# EAGLE design Fathom-X (EAGLE 7.4.0)

## Sheet 1 of 2
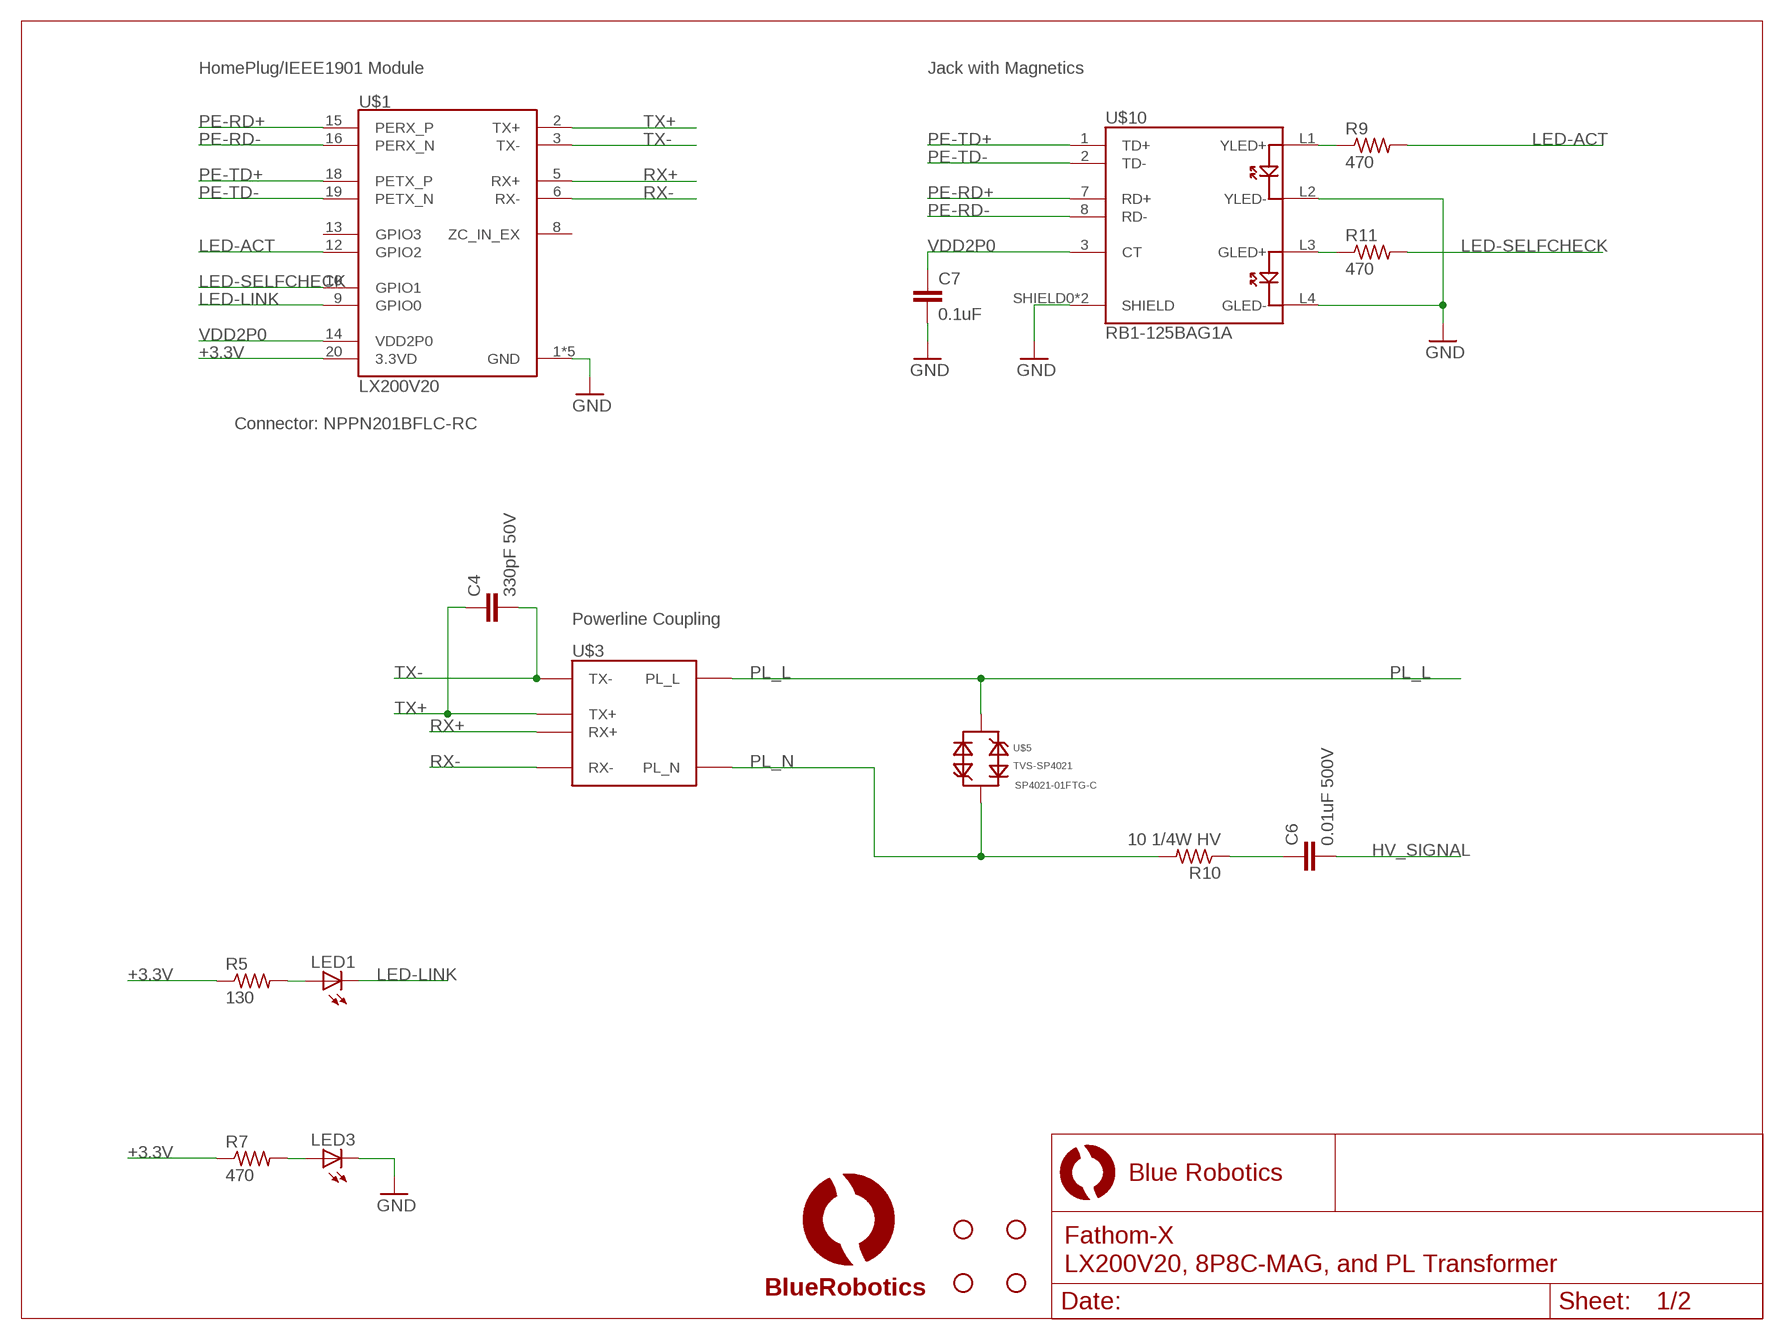
[diagram p0: schematic, sheet 1]

### Parts
C4  330pF 50V  C-EUC0805  [C0805]
C6  0.01uF 500V  C-EUC1206  [C1206]
C7  0.1uF  C-EUC0603  [C0603]
LED1  LEDCHIPLED_0603  [CHIPLED_0603]
LED3  LEDCHIPLED_0603  [CHIPLED_0603]
R5  130  R-US_R0603  [R0603]
R7  470  R-US_R0603  [R0603]
R9  470  R-US_R0603  [R0603]
R10  10 1/4W HV  R-US_R1206  [R1206]
R11  470  R-US_R0603  [R0603]
STANDOFF1  STAND-OFF  [STAND-OFF]
STANDOFF2  STAND-OFF  [STAND-OFF]
STANDOFF3  STAND-OFF  [STAND-OFF]
STANDOFF5  STAND-OFF  [STAND-OFF]
U$1  LX200V20  [LX200V20]
U$3  UT11403S  [UT11403S]
U$5  TVS-SP4021  [SOD323-BIDIRECTIONAL]
U$6  LOGOBR-LOGO-MS-COPPER  [BR-LOGO-MEDIUM-SMALL-COPPER]
U$10  RB1-125BAG1A  RJ45-MAG  [RJ45-MAG-WIZNET]

### Nets
+3.3V: R5.1 R7.1 U$1.20(3.3VD) ; also sheet 2
GND: C7.2 LED3.C U$1.1(GND) U$1.4(GND) U$1.7(GND) U$1.11(GND) U$1.17(GND) U$10.L2(YLED-) U$10.L4(GLED-) U$10.SHIELD0(SHIELD) U$10.SHIELD1(SHIELD) ; also sheet 2
HV_SIGNAL [high-voltage]: C6.2 ; also sheet 2
LED-ACT: R9.2 U$1.12(GPIO2)
LED-LINK: LED1.C U$1.9(GPIO0)
LED-SELFCHECK: R11.2 U$1.10(GPIO1)
N$6: LED1.A R5.2
N$8: LED3.A R7.2
N$11 [high-voltage]: C6.1 R10.1
N$12: R9.1 U$10.L1(YLED+)
N$13: R11.1 U$10.L3(GLED+)
PE-RD+: U$1.15(PERX_P) U$10.7(RD+)
PE-RD-: U$1.16(PERX_N) U$10.8(RD-)
PE-TD+: U$1.18(PETX_P) U$10.1(TD+)
PE-TD-: U$1.19(PETX_N) U$10.2(TD-)
PL_L [high-voltage]: U$3.PL_L U$5.2 ; also sheet 2
PL_N [high-voltage]: R10.2 U$3.PL_N U$5.1
RX+: U$1.5(RX+) U$3.RX+
RX-: U$1.6(RX-) U$3.RX-
TX+: C4.1 U$1.2(TX+) U$3.TX+
TX-: C4.2 U$1.3(TX-) U$3.TX-
VDD2P0: C7.1 U$1.14(VDD2P0) U$10.3(CT)
Unconnected: U$1.8(ZC_IN_EX) U$1.13(GPIO3)

### Notes on the sheet
- HomePlug/IEEE1901 Module | Jack with Magnetics
- Connector: NPPN201BFLC-RC
- Powerline Coupling
- SP4021-01FTG-C

## Sheet 2 of 2
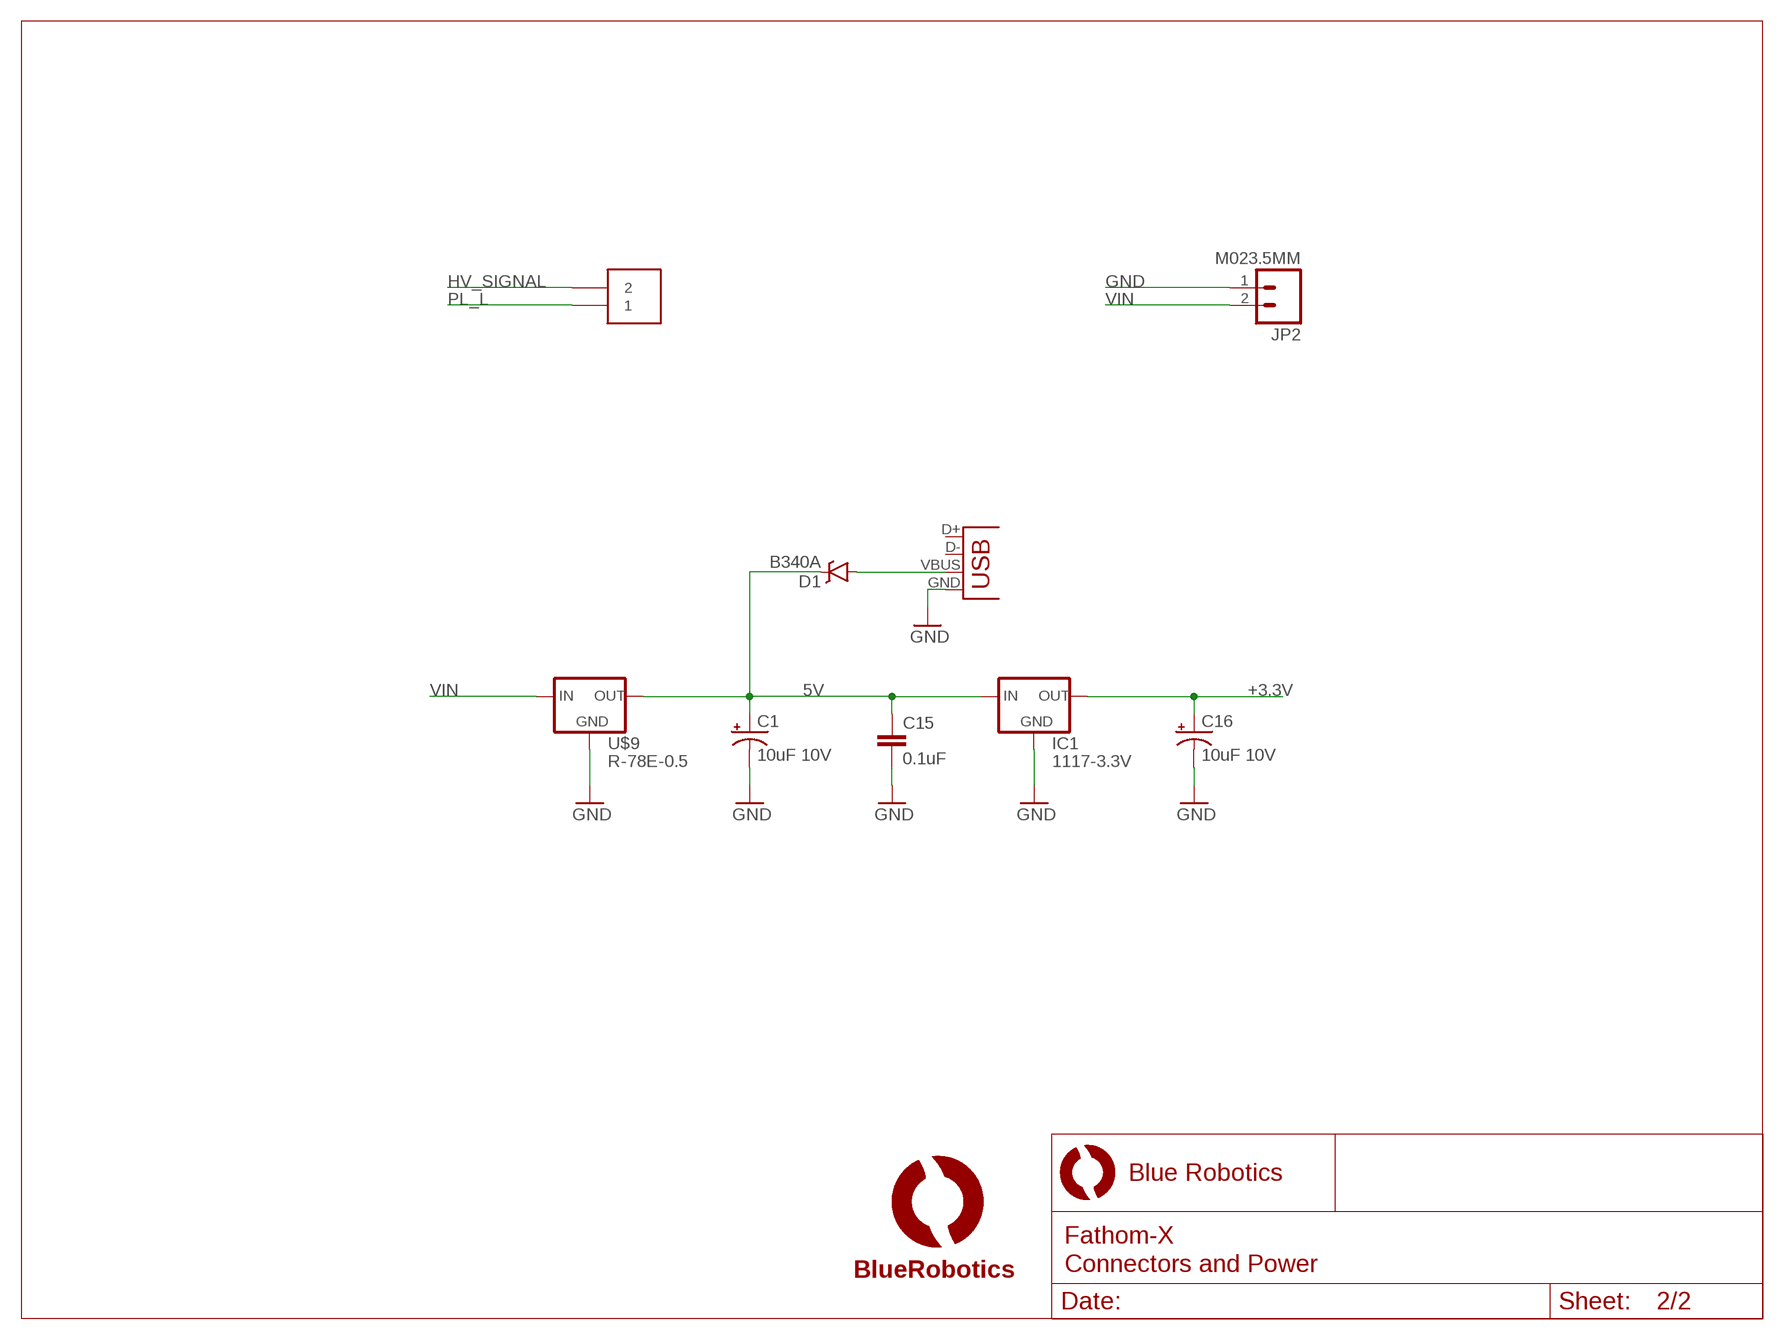
[diagram p1: schematic, sheet 2]

### Parts
C1  10uF 10V  CAP_POL1206  [EIA3216]
C15  0.1uF  CAP0603-CAP  [0603-CAP]
C16  10uF 10V  CAP_POL1206  [EIA3216]
D1  B340A  DIODE-SCHOTTKY-B340A  [SMA-DIODE]
IC1  1117-3.3V  VREG-1117-FIXEDSOT223  [SOT223]
JP2  M023.5MM  [SCREWTERMINAL-3.5MM-2]
JP3  USBSMD  [USB-MINIB]
U$7  LOGOFULL-M  [BR-FULL-LOGO-MEDIUM]
U$8  HEADER-210.16MM  [HEADER-10.16MM-2POS]
U$9  R-78E-0.5  VREG-R-78E-0.5  [R-78E-0.5]

### Nets
5V: C1.A(+) C15.1 D1.C IC1.3(IN) U$9.VOUT(OUT)
+3.3V: C16.A(+) IC1.2(OUT) ; also sheet 1
GND: C1.C(-) C15.2 C16.C(-) IC1.1(GND) JP2.1 JP3.GND U$9.GND ; also sheet 1
HV_SIGNAL [high-voltage]: U$8.P$2 ; also sheet 1
N$1: D1.A JP3.VBUS
PL_L [high-voltage]: U$8.P$1 ; also sheet 1
VIN: JP2.2 U$9.VIN(IN)
Unconnected: JP3.D+ JP3.D-

## Library data of the parts
C1 C16 = SparkFun-Passives:CAP_POL: Capacitor Polarized These are standard SMD and PTH capacitors. Normally 10uF, 47uF, and 100uF in electrolytic and tantalum varieties. Always verify the external diameter of the through hole cap, it varies with capacity, voltage, and manufacturer. The EIA devices should be standard.
C4 C6 C7 = resistor:C-EU: CAPACITOR, European symbol
C15 = SparkFun-Passives:CAP: Capacitor Standard 0603 ceramic capacitor, and 0.1" leaded capacitor.
D1 = SparkFun-DiscreteSemi:DIODE-SCHOTTKY: Schottky diodes in SFE's production catalog BAT20J 1A 23V 0.62Vf RB751 120mA 40V 0.37Vf PMEG4005EJ 0.5A 40V 0.42Vf MBRA140 1A 40V 0.5Vf B340A 3A 40V SMA; PROD_ID: DIO-09886
IC1 = BlueRobotics-Main:VREG-1117-FIXED: Voltage Regulator LM1117 Standard adjustable voltage regulator but in SMD form. Spark Fun Electronics SKU : COM-00595
JP2 = SparkFun-Connectors:M02: Standard 2-pin 0.1" header. Use with - straight break away headers ( PRT-00116) - right angle break away headers (PRT-00553) - swiss pins (PRT-00743) - machine pins (PRT-00117) - female headers (PRT-00115) Molex polarized connector foot print use with: PRT-08233 with associated crimp pins and housings. 2.54_SCREWTERM for use with PRT-10571. 3.5mm Screw Terminal footprints for PRT-08084 5mm Screw Terminal footprints for use with PRT-08433
JP3 = SparkFun-Connectors:USB: USB Connectors USB-B-PTH is fully proven SKU : PRT-00139/CONN-08278 USB-miniB is fully proven SKU : PRT-00587 USB-A-PCB is untested. USB-A-H is throughly reviewed, but untested. Spark Fun Electronics SKU : PRT-00437 USB-B-SMT is throughly reviewed, but untested. Needs silkscreen touching up. USB-A-S has not been used/tested USB-MB-H has not been used/tested USB-MICROB has been used. CONN-09505; PROD_ID: CONN-08193
LED1 LED3 = led:LED: LED OSRAM: - CHIPLED LG R971, LG N971, LY N971, LG Q971, LY Q971, LO R971, LY R971 LH N974, LH R974 LS Q976, LO Q976, LY Q976 LO Q996 - Hyper CHIPLED LW Q18S LB Q993, LB Q99A, LB R99A - SideLED LS A670, LO A670, LY A670, LG A670, LP A670 LB A673, LV A673, LT A673, LW A673 LH A674 LY A675 LS A676, LA A676, LO A676, LY A676, LW A676 LS A679, LY A679, LG A679 - Hyper Micro SIDELED® LS Y876, LA Y876, LO Y876, LY Y876 LT Y87S - SmartLED LW L88C, LW L88S LB L89C, LB L89S, LG L890 LS L89K, LO L89K, LY L89K LS L896, LA L896, LO L896, LY L896 - TOPLED LS T670, LO T670, LY T670, LG T670, LP T670 LSG T670, LSP T670, LSY T670, LOP T670, LYG T670 LG T671, LOG T671, LSG T671 LB T673, LV T673, LT T673, LW T673 LH T674 LS T676, LA T676, LO T676, LY T676, LB T676, LH T676, LSB T676, LW T676 LB T67C, LV T67C, LT T67C, LS T67K, LO T67K, LY T67K, LW E67C LS E67B, LA E67B, LO E67B, LY E67B, LB E67C, LV E67C, LT E67C LW T67C LS T679, LY T679, LG T679 LS T770, LO T770, LY T770, LG T770, LP T770 LB T773, LV T773, LT T773, LW T773 LH T774 LS E675, LA E675, LY E675, LS T675 LS T776, LA T776, LO T776, LY T776, LB T776 LHGB T686 LT T68C, LB T68C - Hyper Mini TOPLED® LB M676 - Mini TOPLED Santana® LG M470 LS M47K, LO M47K, LY M47K Source: http://www.osram.convergy.de LUXEON: - LUMILED® LXK2-PW12-R00, LXK2-PW12-S00, LXK2-PW14-U00, LXK2-PW14-V00 LXK2-PM12-R00, LXK2-PM12-S00, LXK2-PM14-U00 LXK2-PE12-Q00, LXK2-PE12-R00, LXK2-PE12-S00, LXK2-PE14-T00, LXK2-PE14-U00 LXK2-PB12-K00, LXK2-PB12-L00, LXK2-PB12-M00, LXK2-PB14-N00, LXK2-PB14-P00, LXK2-PB14-Q00 LXK2-PR12-L00, LXK2-PR12-M00, LXK2-PR14-Q00, LXK2-PR14-R00 LXK2-PD12-Q00, LXK2-PD12-R00, LXK2-PD12-S00 LXK2-PH12-R00, LXK2-PH12-S00 LXK2-PL12-P00, LXK2-PL12-Q00, LXK2-PL12-R00 Source: www.luxeon.com KINGBRIGHT: KA-3528ASYC Source: www.kingbright.com
R5 R7 R9-R11 = resistor:R-US_: RESISTOR, American symbol
STANDOFF1-STANDOFF3 STANDOFF5 = SparkFun-Electromechanical:STAND-OFF: #4 Stand Off This is the mechanical footprint for a #4 phillips button head screw. Use the keepout ring to avoid running the screw head into surrounding components. SKU : PRT-00447
U$1 = BR-Eagle-Library:LX200V20
U$3 = BlueRobotics-Main:UT11403S
U$5 = BlueRobotics-Main:TVS-SP4021
U$6 U$7 = BlueRobotics-Main:LOGO
U$8 = BlueRobotics-Main:HEADER-2
U$9 = BlueRobotics-Main:VREG-R-78E-0.5
U$10 = BlueRobotics-Main:RJ45-MAG

## Net classes
1 high-voltage: clearance 0.762 mm

## Board
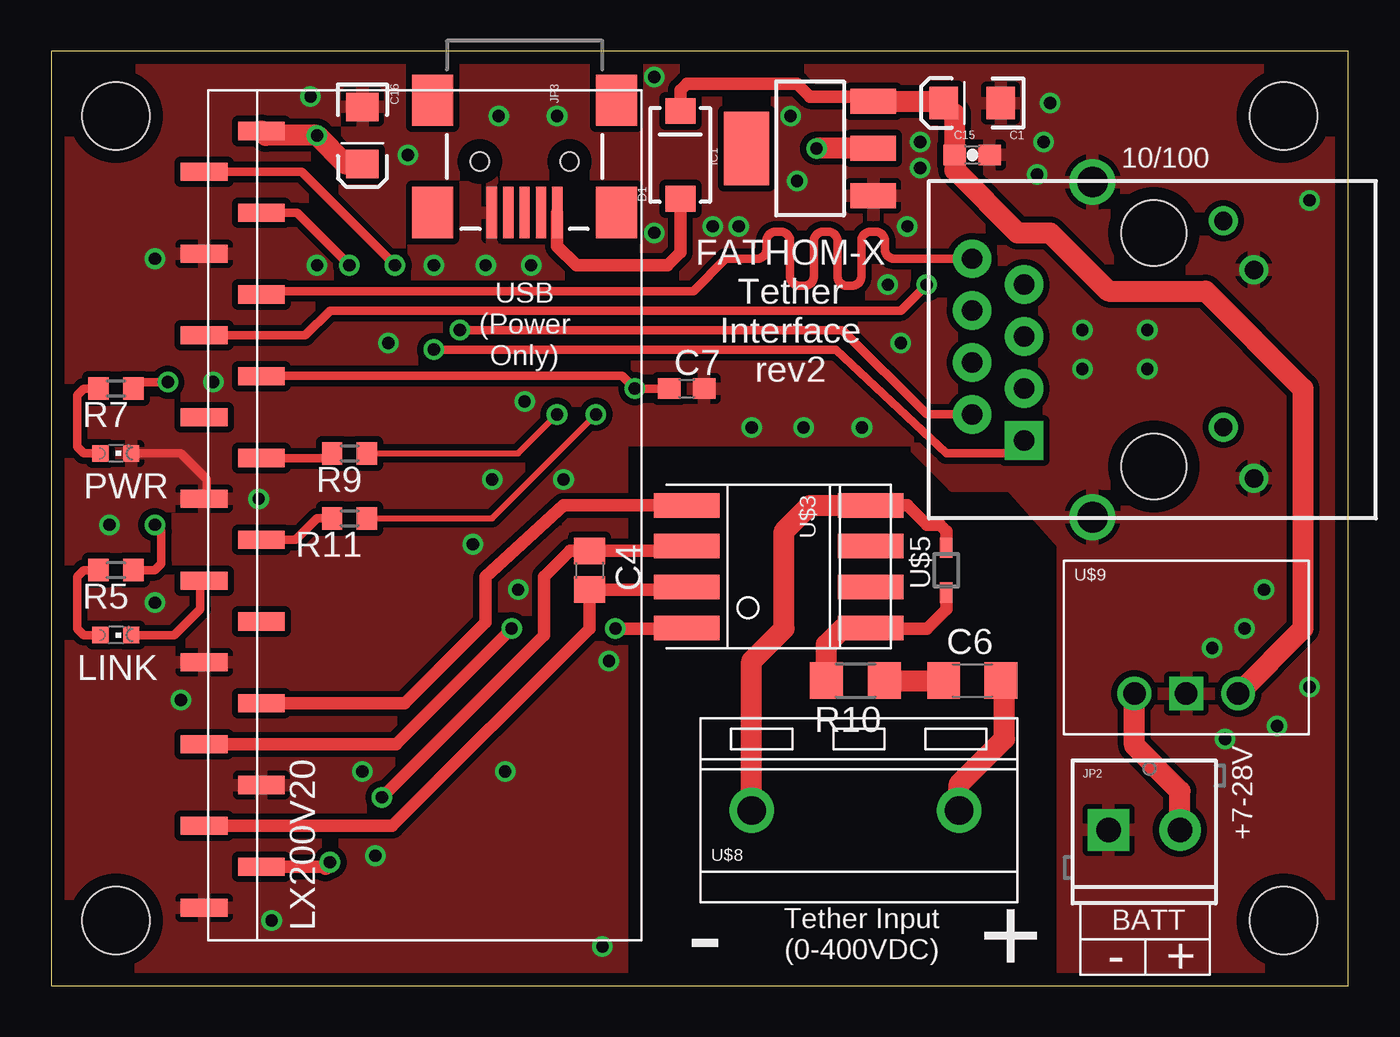
[diagram p2: board, top side]
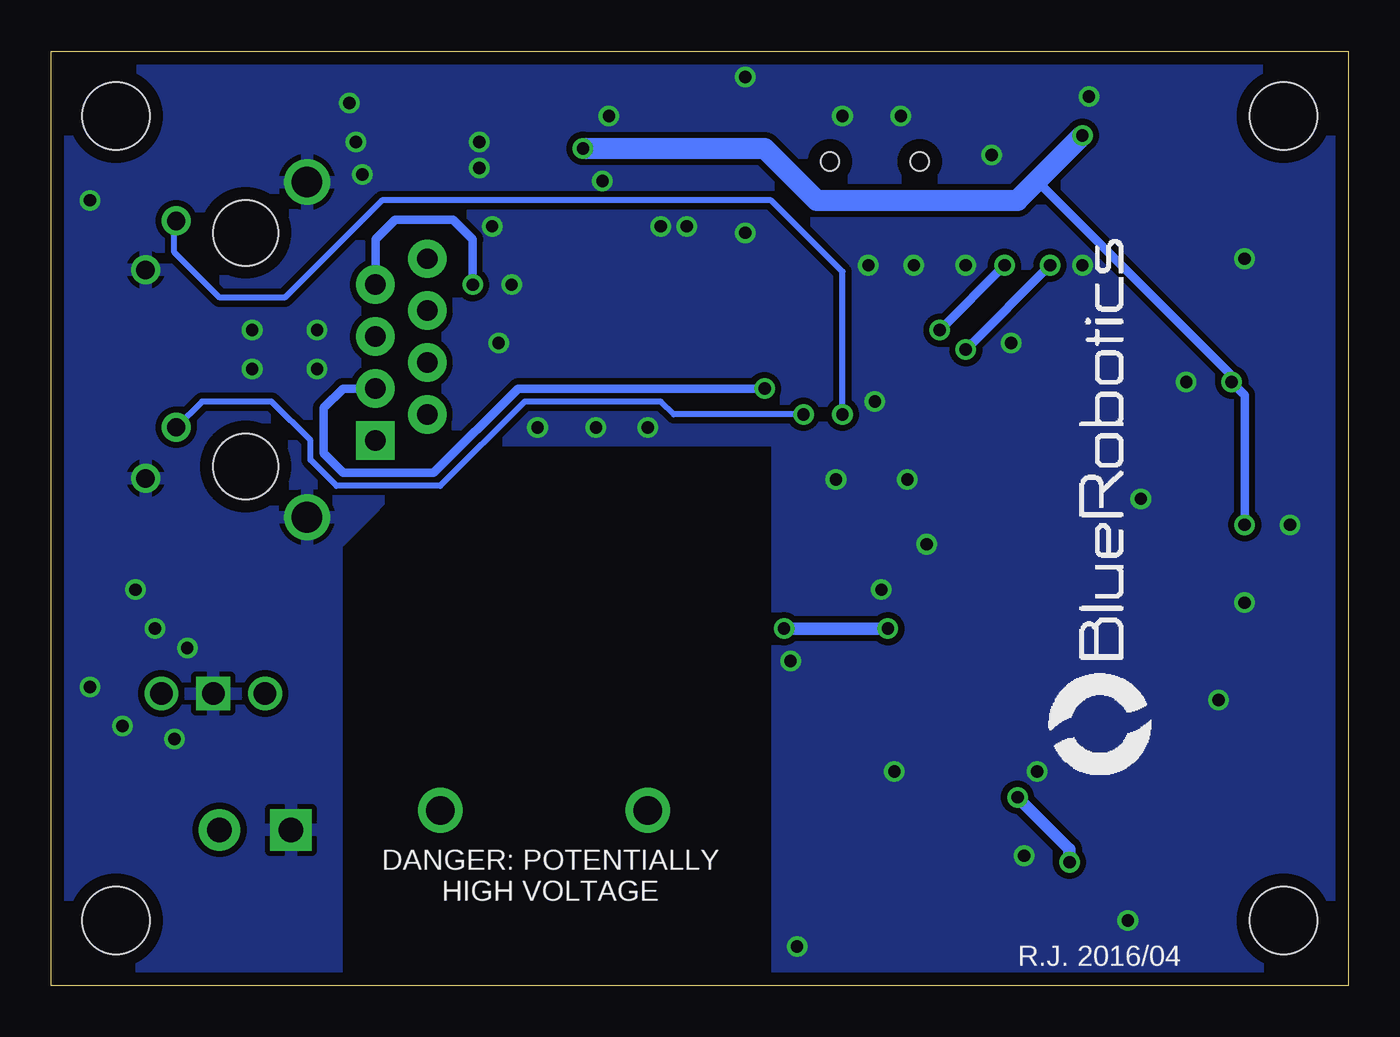
[diagram p3: board, bottom side, seen from below]

Size 63.5 x 45.72 mm. Coordinates in mm from the lower left corner, seen from the top.
Outline: 0,0 63.5,0 63.5,45.72 0,45.72 0,0
Copper layers (1*16): Top 0.035mm / dielectric 1.5mm / Bottom 0.035mm
Design rules "default *": minimum track width 10mil, minimum drill 13mil, track to track 8mil, track to pad 8mil, pad to pad 8mil, via to via 8mil, smd to smd 8mil, copper to edge 25mil, drill to drill 8mil, minimum pad ring 10mil, minimum via ring 8mil, stop-mask expansion 4mil, vias tented up to drill 30mil, thermal gap 10mil

### Footprints (pad centres in the part's own frame; a part is rotated, then mirrored left to right if it is on the bottom)
EIA3216 = smd 1.4 x 1.6: A 1.4,0; C -1.4,0
C0805 = smd 1.3 x 1.5: 1 -0.95,0; 2 0.95,0
C1206 = smd 1.6 x 1.8: 1 -1.4,0; 2 1.4,0
C0603 = smd 1.1 x 1: 1 -0.85,0; 2 0.85,0
0603-CAP = smd 1.1 x 1: 1 -0.85,0; 2 0.85,0
SMA-DIODE = smd 1.27 x 1.47: A -2.15,0; C 2.15,0
SOT223 = smd 1.219 x 2.235: 1 -2.311,-3.099; 2 0,-3.099; 3 2.311,-3.099 | smd 3.6 x 2.2: 4 0,3.099
SCREWTERMINAL-3.5MM-2 = drill 1.2 pad 2.032 square: 1 0,0 | drill 1.2 pad 2.032: 2 3.5,0
USB-MINIB = smd 2.5 x 0.5: D+ 2.5,0; D- 2.5,0.8; GND 2.5,-1.6; ID 2.5,-0.8; VBUS 2.5,1.6 | smd 2.5 x 2: MTN1 -3,4.5; MTN2 2.5,4.5; MTN3 -3,-4.5; MTN4 2.5,-4.5 | hole 0.9: 0,2.2; 0,-2.2
CHIPLED_0603 = smd 0.8 x 0.8: A 0,-0.75; C 0,0.75
R0603 = smd 1 x 1.1: 1 -0.85,0; 2 0.85,0
R1206 = smd 1.6 x 1.803: 1 -1.422,0; 2 1.422,0
STAND-OFF = hole 3.302: 0,0
LX200V20 = smd 0.89 x 2.29: 1 0,1.4; 2 2,-1.4; 3 4,1.4; 4 6,-1.4; 5 8,1.4; 6 10,-1.4; 7 12,1.4; 8 14,-1.4; 9 16,1.4; 10 18,-1.4; 11 20,1.4; 12 22,-1.4; 13 24,1.4; 14 26,-1.4; 15 28,1.4; 16 30,-1.4; 17 32,1.4; 18 34,-1.4; 19 36,1.4; 20 38,-1.4
UT11403S = smd 1.2 x 3.2: NC0 4,9; NC1 2,9; PL_L 0,9; PL_N 6,9; RX+ 6,0; RX- 0,0; TX+ 2,0; TX- 4,0
SOD323-BIDIRECTIONAL = smd 1 x 0.6: 1 -1.1,0; 2 1.1,0
HEADER-10.16MM-2POS = drill 1.4 pad 2.184: P$1 0,0; P$2 10.16,0
R-78E-0.5 = drill 1.1 square: GND 0,0 | drill 1.1: VIN -2.54,0; VOUT 2.54,0
RJ45-MAG-WIZNET = drill 1 pad 1.88 square: 1 -4.445,6.35 | drill 1 pad 1.88: 2 -3.175,8.89; 3 -1.905,6.35; 4 -0.635,8.89; 5 0.635,6.35; 6 1.905,8.89; 7 3.175,6.35; 8 4.445,8.89 | drill 0.9: L1 6.3,-3.4; L2 3.9,-4.9; L3 -3.8,-3.4; L4 -6.3,-4.9 | drill 1.5: SHIELD0 -8.2,3; SHIELD1 8.2,3 | hole 3.2: -5.715,0; 5.715,0

### Placement (x,y rotation side)
C1  45.09,43.18 180 top
C4  26.35,20.32 270 top
C6  45.09,14.92 0 top
C7  31.11,29.21 0 top
C15  45.09,40.64 0 top
C16  15.24,41.59 270 top
D1  30.8,40.64 90 top
IC1  37.15,40.96 90 top
JP2  51.75,7.62 0 top
JP3  23.18,40.32 270 top
LED1  3.17,17.14 270 top
LED3  3.17,26.04 270 top
R5  3.17,20.32 180 top
R7  3.17,29.21 180 top
R9  14.61,26.04 180 top
R10  39.37,14.92 180 top
R11  14.61,22.86 180 top
STANDOFF1  3.17,3.17 0 top
STANDOFF2  60.33,3.17 0 top
STANDOFF3  60.33,42.55 0 top
STANDOFF5  3.17,42.55 0 top
U$1  8.89,3.81 90 top
U$3  31.11,23.5 270 top
U$5  43.81,20.32 90 top
U$6  1.27,7.62 0 top
U$7  8.26,8.26 90 bottom
U$8  34.29,8.57 0 top
U$9  55.56,14.29 0 top
U$10  53.98,31.11 90 top

### Tracks (layer width: path | path; a pad name or v marks a point on that pad's centre or on a via)
5V
  Top 0.61: D1.C 30.8,43.81 31.11,44.13 36.51,44.13 37.15,43.5 40.02,43.5 IC1.3 | 43.6,43.27 C1.A 44.23,42.63 | 57.78,13.97 U$9.VOUT
  Top 1.016: IC1.3 43.6,43.27 | 44.23,42.63 C15.1 44.23,39.9 47.31,36.83 48.9,36.83 51.75,33.97 56.52,33.97 61.28,29.21 61.28,17.46 U$9.VOUT
+3.3V  (via drill 0.6)
  Top 0.406: R5.1 5.08,20.32 5.4,20.64 5.4,22.23 v5.08,22.54 | v5.71,29.53 4.34,29.53 R7.1
  Top 1.016: IC1.2 v37.47,40.96 | U$1.20 10.51,41.59 v13.02,41.59 14.42,40.19 C16.A
  Bottom 0.406: v5.08,22.54 5.08,28.89 v5.71,29.53 5.71,29.84 15.24,39.37
  Bottom 1.016: v37.47,40.96 28.57,40.96 26.04,38.42 16.19,38.42 15.24,39.37 v13.02,41.59
GND  (via drill 0.6)
  Top 0.406: LED3.C 6.35,26.04 7.62,24.77 7.62,23.94 U$1.11
  other vias: 22.23,10.48 15.24,10.48 2.86,22.54 23.18,28.57 21.59,24.77 25.08,24.77 20.64,21.59 39.69,27.3 36.83,27.3 34.29,27.3 16.51,31.43 7.94,29.53 5.08,35.56 10.16,23.81 6.35,13.97 10.79,3.17 26.99,1.91 15.88,6.35 33.66,37.15 41.59,31.43 40.96,34.29 41.91,37.15 48.9,43.18 50.48,32.07 27.3,15.88 22.86,19.37 61.59,38.42 50.48,30.16 53.66,32.07 53.66,30.16 36.51,39.37 48.26,39.69 5.08,18.73 18.73,35.24 21.27,35.24 23.5,35.24 42.55,40.01 24.77,42.55 21.91,42.55 17.46,40.64 12.7,43.5 13.02,35.24 59.37,19.37 58.42,17.46 56.83,16.51 57.47,12.06 60.01,12.7 61.59,14.61 42.55,41.27 32.38,37.15 48.58,41.27 29.53,44.45 36.2,42.55 29.53,36.83
  pour Bottom (isolate 0.305): -2.54,48.26 -2.54,0 27.94,0 27.94,26.67 41.91,26.67 43.18,25.4 45.72,25.4 49.53,21.59 49.53,-2.54 66.04,-2.54 66.04,48.26
  pour Top (isolate 0.305): -2.54,-2.54 27.94,-2.54 27.94,26.67 41.91,26.67 44.13,24.45 46.99,24.45 49.53,21.59 49.53,-2.54 66.04,-2.54 66.04,48.26 0,48.26 0,0
HV_SIGNAL
  Top 1.016: U$8.P$2 44.45,9.84 46.67,12.06 46.67,14.73 C6.2
LED-ACT
  Top 0.406: U$1.12 13.53,25.81 R9.2
LED-LINK
  Top 0.406: LED1.C 6.03,17.14 7.3,18.41 7.3,19.62 U$1.9
LED-SELFCHECK
  Top 0.406: U$1.10 11.97,21.81 13.02,22.86 R11.2
N$1
  Top 0.61: JP3.VBUS 24.78,36.18 25.72,35.24 30.16,35.24 30.8,35.88 D1.A
N$6
  Top 0.406: LED1.A 1.59,17.14 1.27,17.46 1.27,20 1.59,20.32 R5.2
N$8
  Top 0.406: LED3.A 1.59,26.04 1.27,26.35 1.27,28.89 1.59,29.21 R7.2
N$11
  Top 1.016: R10.1 C6.1
N$12  (via drill 0.6)
  Top 0.305: R9.1 22.86,26.04 v24.77,27.94
  Bottom 0.305: v24.77,27.94 24.77,34.92 28.26,38.42 47.31,38.42 52.07,33.66 55.24,33.66 57.47,35.88 57.47,37.32 U$10.L1
N$13  (via drill 0.6)
  Top 0.305: R11.1 21.59,22.86 v26.67,27.94
  Bottom 0.305: v26.67,27.94 33.02,27.94 33.66,28.57 40.32,28.57 44.45,24.45 49.53,24.45 50.8,25.72 50.8,26.67 52.7,28.57 56.12,28.57 U$10.L3
PE-RD+  (via drill 0.6)
  Top 0.406: U$1.15 12.44,31.81 13.65,33.02 41.59,33.02 v42.86,34.29
  Bottom 0.406: v42.86,34.29 42.86,36.51 43.81,37.47 46.67,37.47 47.62,36.51 U$10.7
PE-RD-
  Top 0.406: U$10.8 41.27,35.56 arc-90 40.82,36.02 40.82,36.43 arc90 40.36,36.88 40.11,36.88 arc90 39.66,36.43 39.66,34.69 arc-90 39.2,34.24 38.95,34.24 arc-90 38.49,34.69 38.49,36.43 arc90 38.04,36.88 37.79,36.88 arc90 37.33,36.43 37.33,34.69 arc-90 36.88,34.24 36.63,34.24 arc-90 36.17,34.69 36.17,36.43 arc90 35.72,36.88 35.47,36.88 arc90 35.01,36.43 35.01,36.02 arc-90 34.55,35.56 33.02,35.56 31.43,33.97 10.45,33.97 U$1.16
PE-TD+  (via drill 0.6)
  Top 0.406: U$1.18 12.04,37.81 v14.61,35.24 | v18.73,31.11 38.42,31.11 43.81,26.04 46.99,26.04 U$10.1
  Bottom 0.406: v14.61,35.24 v18.73,31.11
PE-TD-  (via drill 0.6)
  Top 0.406: U$1.19 12.26,39.81 v16.83,35.24 | v20,32.07 38.73,32.07 42.86,27.94 U$10.2
  Bottom 0.406: v16.83,35.24 v20,32.07
PL_L
  Top 0.61: U$5.2 43.81,22.23 43.5,22.54 42.86,22.54 41.91,23.5 U$3.PL_L
  Top 1.016: 40.32,23.5 U$3.PL_L 37.15,23.5 35.88,22.23 35.88,17.46 34.29,15.88 U$8.P$1
PL_N
  Top 0.61: 40.15,17.46 42.86,17.46 43.81,18.41 U$5.1
  Top 1.016: 40.17,17.44 40.15,17.46 U$3.PL_N 40.08,17.46 38.73,17.46 37.95,16.68 R10.2
RX+  (via drill 0.6)
  Top 0.61: U$1.5 16.89,11.81 v22.54,17.46 | v27.62,17.46 31.08,17.46 U$3.RX+
  Bottom 0.61: v22.54,17.46 v27.62,17.46
RX-
  Top 0.61: U$3.RX- 25.08,23.5 21.27,20 21.27,17.78 17.3,13.81 U$1.6
TX+  (via drill 0.6)
  Top 0.61: U$1.2 13.43,5.81 | v16.19,9.21 24.13,17.14 24.13,20 25.4,21.27 C4.1 30.89,21.27 U$3.TX+
  Top 0.813: 13.43,5.81 v13.65,6.03
  Bottom 0.61: v13.65,6.03 13.65,6.67 v16.19,9.21
TX-
  Top 0.61: U$1.3 16.7,7.81 26.35,17.46 C4.2 30.99,19.37 U$3.TX-
VDD2P0  (via drill 0.6)
  Top 0.406: U$1.14 10.32,29.84 27.94,29.84 v28.57,29.21 C7.1
  Bottom 0.406: v28.57,29.21 40.64,29.21 44.77,25.08 49.21,25.08 50.16,26.04 50.16,28.26 49.21,29.21 U$10.3
VIN
  Top 1.016: JP2.2 55.25,9.52 53.02,11.75 U$9.VIN

### Text on the board
tPlace: 10/100 | FATHOM-X / Tether / Interface / rev2 | USB / (Power / Only) | PWR | LINK | +7-28V | Tether Input / (0-400VDC) | BATT | - | + | - | +
bPlace: DANGER: POTENTIALLY / HIGH VOLTAGE | R.J. 2016/04